# EAGLE schematic hab_tracker (EAGLE 8.2.2)

## Sheet 1 of 2
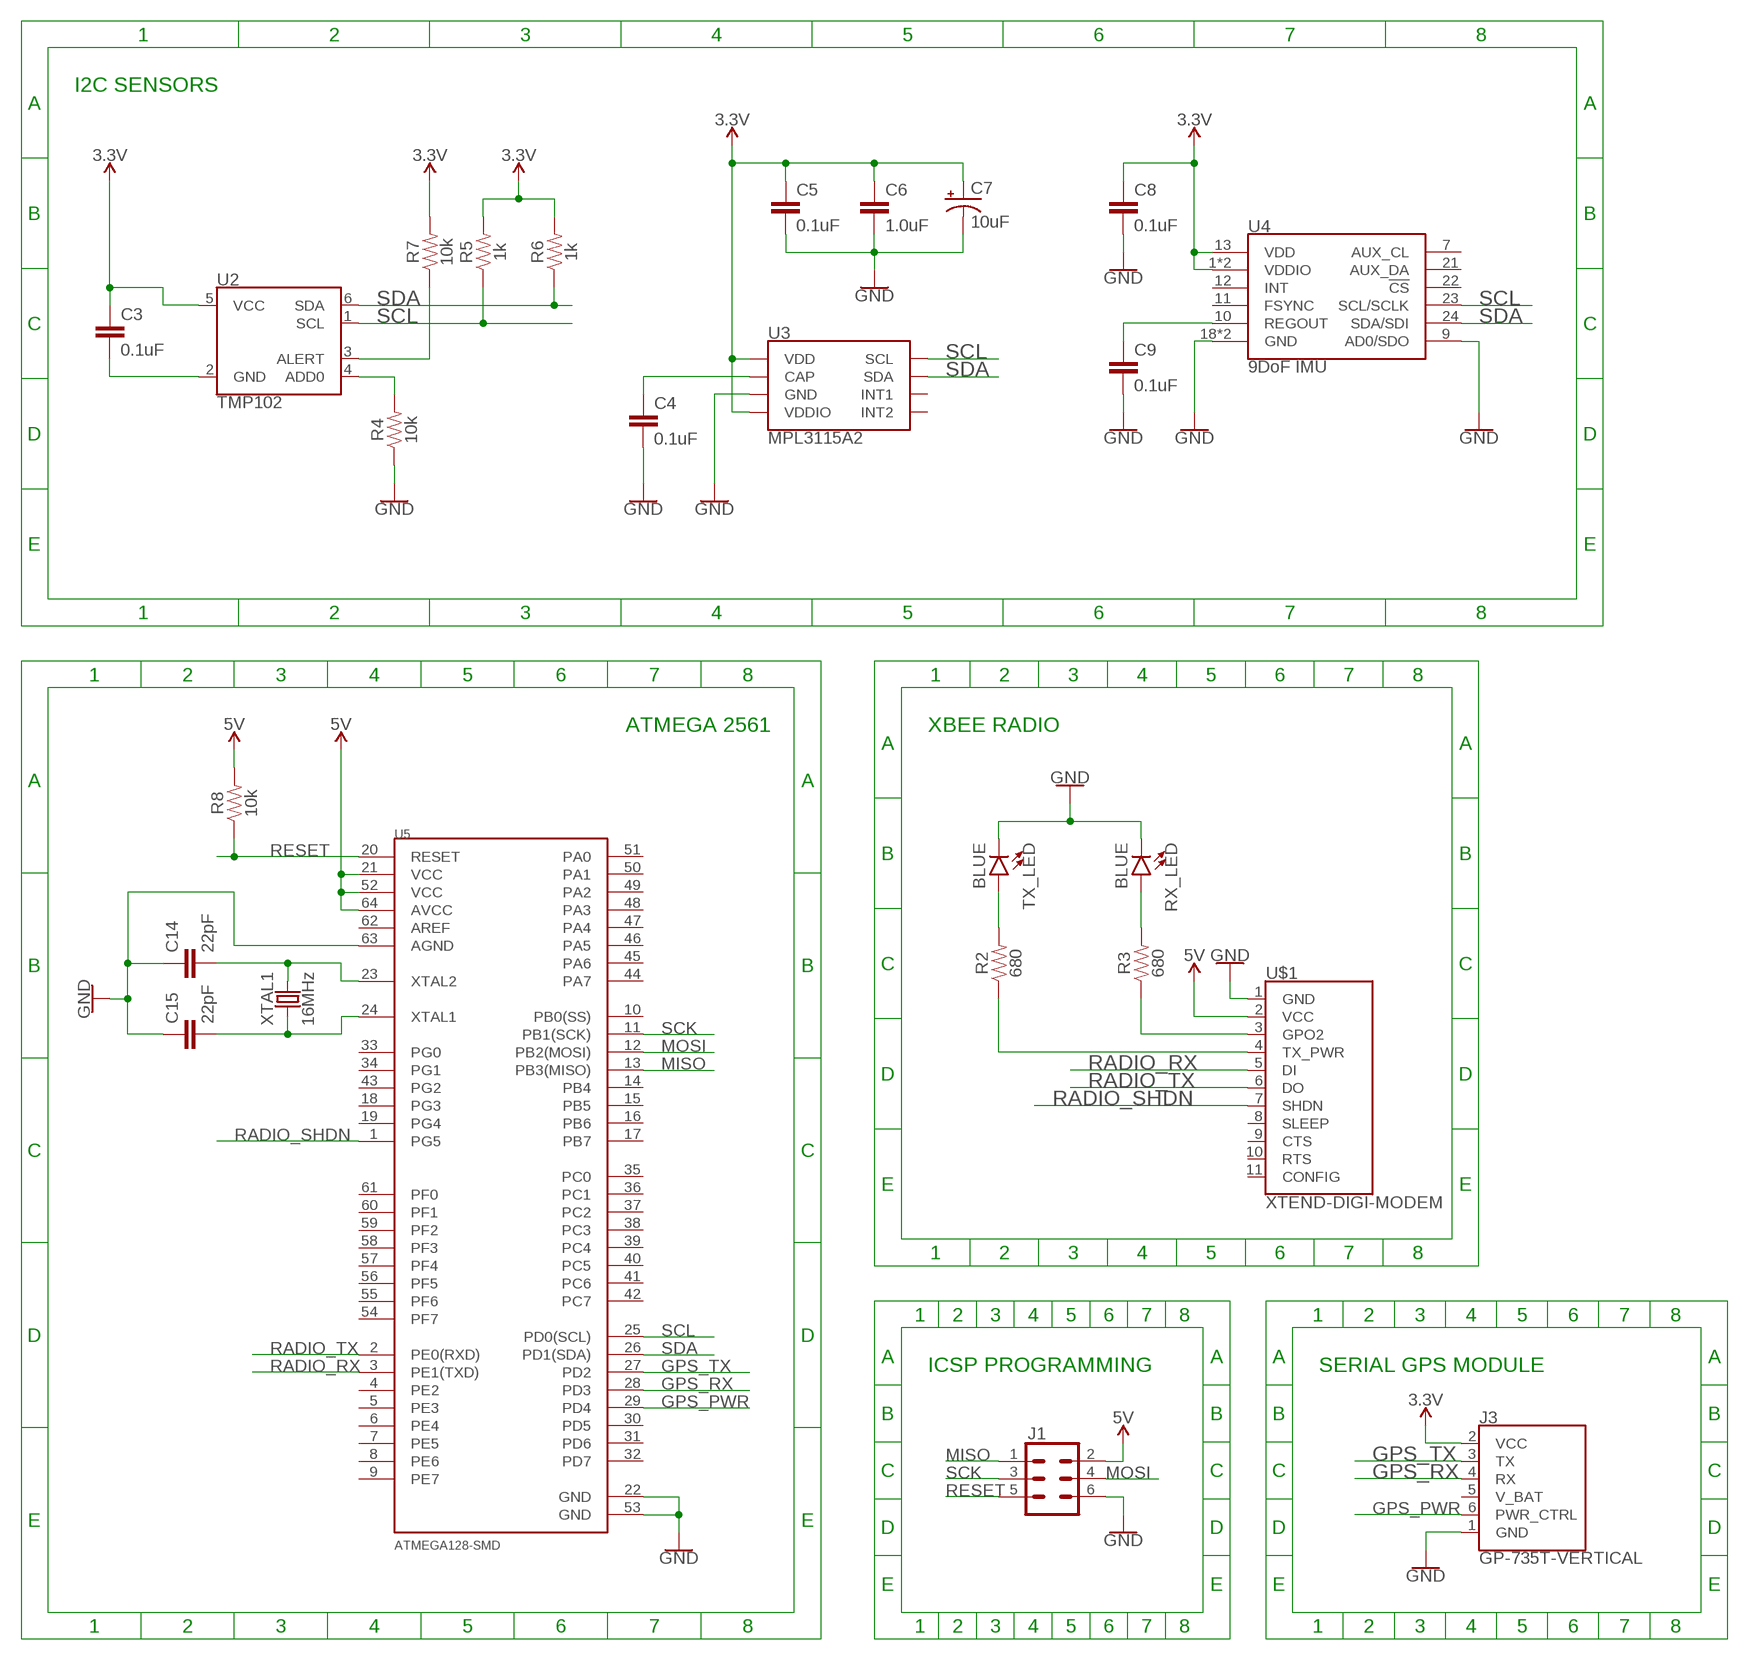
[diagram p0: schematic, sheet 1]

### Parts
C3  0.1uF  0.1UF-0603-25V-(+80/-20%)  [0603]
C4  0.1uF  0.1UF-0603-25V-(+80/-20%)  [0603]
C5  0.1uF  0.1UF-KIT-EZ-50V-20%  [CAP-PTH-SMALL-KIT]
C6  1.0uF  1.0UF-0603-16V-10%  [0603]
C7  10uF  10UF-POLAR-0603-6.3V-20%(TANT)  [0603-POLAR]
C8  0.1uF  0.1UF-KIT-EZ-50V-20%  [CAP-PTH-SMALL-KIT]
C9  0.1uF  0.1UF-KIT-EZ-50V-20%  [CAP-PTH-SMALL-KIT]
C14  22pF  22PF-0603-50V-5%  [0603]
C15  22pF  22PF-0603-50V-5%  [0603]
J1  CONN_03X2SHROUD  [2X3-SHROUDED]
J3  GP-735T-VERTICAL  [JST-6PIN-1MM]
R2  680  680OHM-0603-1/10W-5%  [0603]
R3  680  680OHM-0603-1/10W-5%  [0603]
R4  10k  10KOHM-0603-1/10W-1%  [0603]
R5  1k  1KOHM-0603-1/10W-1%  [0603]
R6  1k  1KOHM-0603-1/10W-1%  [0603]
R7  10k  10KOHM-0603-1/10W-1%  [0603]
R8  10k  10KOHM-0603-1/10W-1%  [0603]
RX_LED  BLUE  LED-BLUE1206  [LED-1206]
TX_LED  BLUE  LED-BLUE1206  [LED-1206]
U2  TMP102  [SOT563]
U3  MPL3115A2  [LGA-8-5X3]
U4  9DoF IMU  MPU-9250  [QFN24-3X3]
U5  ATMEGA128-SMD  [TQFP64_14X14MM]
U$1  XTEND-DIGI-MODEM  [XTEND-DIGI-MODEM]
XTAL1  16MHz  CRYSTAL-16MHZSMD-5X3.2  [CRYSTAL-SMD-5X3.2-4PAD]

### Nets
3.3V: C3.1 C5.1 C6.1 C7.+ C8.1 J3.2(VCC) R5.2 R6.2 R7.2 U2.5(VCC) U3.1(VDD) U3.4(VDDIO) U4.1(VDDIO) U4.8(VDDIO) U4.13(VDD) ; also sheet 2
5V: J1.2 R8.2 U5.21(VCC) U5.52(VCC) U5.64(AVCC) U$1.2(VCC) ; also sheet 2
GND: C4.2 C5.2 C6.2 C7.- C8.2 C9.2 C14.1 C15.1 J1.6 J3.1(GND) R4.1 RX_LED.C TX_LED.C U3.3(GND) U4.9(AD0/SDO) U4.18(GND) U4.20(GND) U5.22(GND) U5.53(GND) U5.63(AGND) U$1.1(GND) ; also sheet 2
GPS_PWR: J3.6(PWR_CTRL) U5.29(PD4)
GPS_RX: J3.4(RX) U5.28(PD3)
GPS_TX: J3.3(TX) U5.27(PD2)
MISO: J1.1 U5.13(PB3(MISO))
MOSI: J1.4 U5.12(PB2(MOSI))
N$3: R3.1 U$1.3(GPO2)
N$4: R2.1 U$1.4(TX_PWR)
N$5: R2.2 TX_LED.A
N$6: R3.2 RX_LED.A
N$7: C9.1 U4.10(REGOUT)
N$8: C3.2 U2.2(GND)
N$9: R7.1 U2.3(ALERT)
N$10: C4.1 U3.2(CAP)
N$11: R4.2 U2.4(ADD0)
N$16: C14.2 U5.23(XTAL2) XTAL1.3
N$17: C15.2 U5.24(XTAL1) XTAL1.1
RADIO_RX: U5.3(PE1(TXD)) U$1.5(DI)
RADIO_SHDN: U5.1(PG5) U$1.7(SHDN)
RADIO_TX: U5.2(PE0(RXD)) U$1.6(DO)
RESET: J1.5 R8.1 U5.20(RESET)
SCK: J1.3 U5.11(PB1(SCK))
SCL: R5.1 U2.1(SCL) U3.8(SCL) U4.23(SCL/SCLK) U5.25(PD0(SCL))
SDA: R6.1 U2.6(SDA) U3.7(SDA) U4.24(SDA/SDI) U5.26(PD1(SDA))
Unconnected: J3.5(V_BAT) U3.5(INT2) U3.6(INT1) U4.7(AUX_CL) U4.11(FSYNC) U4.12(INT) U4.21(AUX_DA) U4.22(!CS) U5.4(PE2) U5.5(PE3) U5.6(PE4) U5.7(PE5) U5.8(PE6) U5.9(PE7) U5.10(PB0(SS)) U5.14(PB4) U5.15(PB5) U5.16(PB6) U5.17(PB7) U5.18(PG3) U5.19(PG4) U5.30(PD5) U5.31(PD6) U5.32(PD7) U5.33(PG0) U5.34(PG1) U5.35(PC0) U5.36(PC1) U5.37(PC2) U5.38(PC3) U5.39(PC4) U5.40(PC5) U5.41(PC6) U5.42(PC7) U5.43(PG2) U5.44(PA7) U5.45(PA6) U5.46(PA5) U5.47(PA4) U5.48(PA3) U5.49(PA2) U5.50(PA1) U5.51(PA0) U5.54(PF7) U5.55(PF6) U5.56(PF5) U5.57(PF4) U5.58(PF3) U5.59(PF2) U5.60(PF1) U5.61(PF0) U5.62(AREF) U$1.8(SLEEP) U$1.9(CTS) U$1.10(RTS) U$1.11(CONFIG)

### Notes on the sheet
- I2C SENSORS
- ATMEGA 2561 | XBEE RADIO
- ICSP PROGRAMMING | SERIAL GPS MODULE

## Sheet 2 of 2
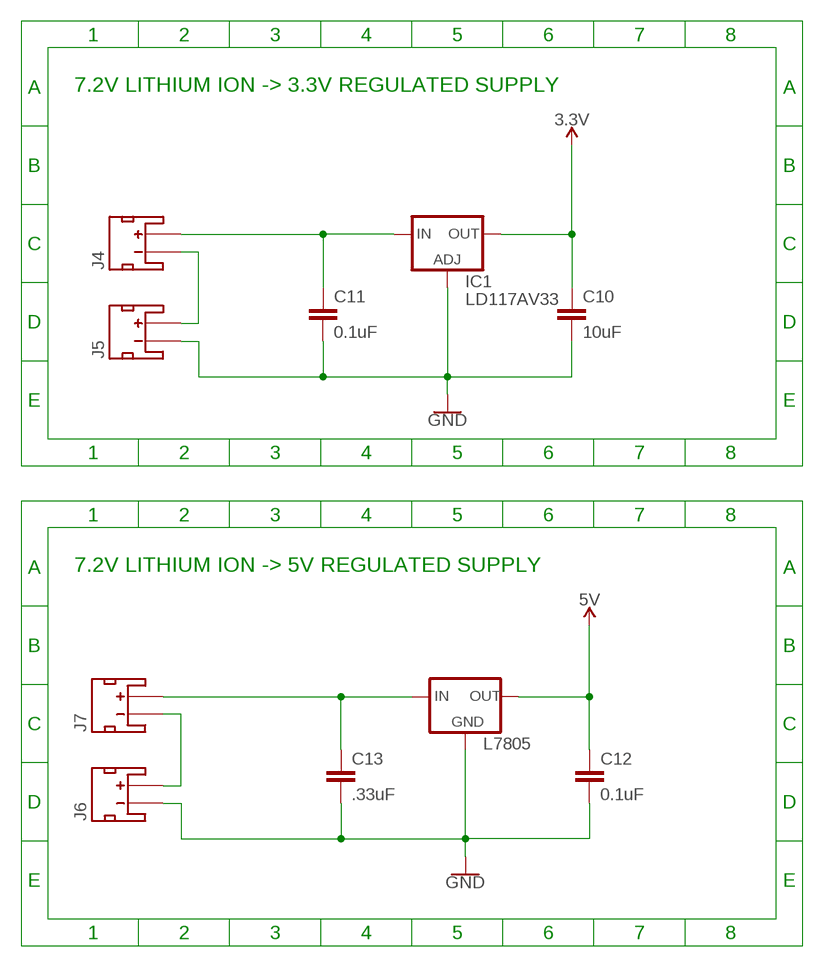
[diagram p1: schematic, sheet 2]

### Parts
C10  10uF  10UF-0603-6.3V-20%  [0603]
C11  0.1uF  0.1UF-0603-25V-(+80/-20%)  [0603]
C12  0.1uF  0.1UF-0603-25V-(+80/-20%)  [0603]
C13  .33uF  1.0NF/1000PF-0603-50V-10%  [0603]
IC1  LD117AV33  [TO220L1]
J4  JST_2MM_MALE  [JST-2-SMD]
J5  JST_2MM_MALE  [JST-2-SMD]
J6  JST_2MM_MALE  [JST-2-SMD]
J7  JST_2MM_MALE  [JST-2-SMD]
L7805  V_REG_78XX-TO-220  [TO-220-ALT]

### Nets
3.3V: C10.1 IC1.2(OUT) ; also sheet 1
5V: C12.1 L7805.OUT ; also sheet 1
GND: C10.2 C11.2 C12.2 C13.2 IC1.1(ADJ) J5.1(-) J6.1(-) L7805.GND ; also sheet 1
N$12: J4.1(-) J5.2(+)
N$13: C11.1 IC1.3(IN) J4.2(+)
N$14: J6.2(+) J7.1(-)
N$15: C13.1 J7.2(+) L7805.IN
Unconnected: J4.NC1(PAD1) J4.NC2(PAD2) J5.NC1(PAD1) J5.NC2(PAD2) J6.NC1(PAD1) J6.NC2(PAD2) J7.NC1(PAD1) J7.NC2(PAD2)

### Notes on the sheet
- 7.2V LITHIUM ION -> 3.3V REGULATED SUPPLY
- 7.2V LITHIUM ION -> 5V REGULATED SUPPLY

## Library data of the parts
C3 C4 C11 C12 = SparkFun-Capacitors:0.1UF: 0.1µF ceramic capacitors A capacitor is a passive two-terminal electrical component used to store electrical energy temporarily in an electric field.; PROD_ID: CAP-00810
C5 C8 C9 = SparkFun-Capacitors:0.1UF: 0.1µF ceramic capacitors A capacitor is a passive two-terminal electrical component used to store electrical energy temporarily in an electric field.; PROD_ID: CAP-08370
C6 = SparkFun-Capacitors:1.0UF: 1µF ceramic capacitors A capacitor is a passive two-terminal electrical component used to store electrical energy temporarily in an electric field.; PROD_ID: CAP-00868
C7 = SparkFun-Capacitors:10UF-POLAR: 10.0µF polarized capacitors A capacitor is a passive two-terminal electrical component used to store electrical energy temporarily in an electric field.; PROD_ID: CAP-13210
C10 = SparkFun-Capacitors:10UF: 10.0µF ceramic capacitors A capacitor is a passive two-terminal electrical component used to store electrical energy temporarily in an electric field.; PROD_ID: CAP-11015
C13 = SparkFun-Capacitors:1.0NF/1000PF: 1nF/1,000pF ceramic capacitors A capacitor is a passive two-terminal electrical component used to store electrical energy temporarily in an electric field.; PROD_ID: CAP-07886; VALUE: 1nF
C14 C15 = SparkFun-Capacitors:22PF: 22pF ceramic capacitors A capacitor is a passive two-terminal electrical component used to store electrical energy temporarily in an electric field.; PROD_ID: CAP-07876
IC1 = v-reg:LD117A?*: Low drop fixed and adjustable positive voltage regulators 1 A Source: http://www.st.com/stonline/products/literature/ds/7194/ld1117axx.pdf
J1 = SparkFun-Connectors:CONN_03X2: Multi connection point. Often used as Generic Header-pin footprint for 0.1 inch spaced/style header connections You can populate with any combo of single row headers, but if you'd like an exact match, check these: Header - 2x3 (Male, 0.1") <https://www.sparkfun.com/products/12807> (PRT-12807) Header - 2x3 (Female, 0.1") <https://www.sparkfun.com/products/13010> (PRT-13010) 2x3 Pin Shrouded Header <https://www.sparkfun.com/products/10877> (PRT-10877) On any of the 0.1 inch spaced packages, you can populate with these: Break Away Headers - Straight <https://www.sparkfun.com/products/116> (PRT-00116) Break Away Male Headers - Right Angle <https://www.sparkfun.com/products/553> (PRT-00553) Female Headers <https://www.sparkfun.com/products/115> (PRT-00115) Break Away Headers - Machine Pin <https://www.sparkfun.com/products/117> (PRT-00117) Break Away Female Headers - Swiss Machine Pin <https://www.sparkfun.com/products/743> (PRT-00743) Special note: the shrouded connector mates well with our 3x2 ribbon cables: Ribbon Crimp Connector - 6-pin (2x3, Female) <https://www.sparkfun.com/products/10651> (PRT-10651) Ribbon Cable - 6 wire (15ft) <https://www.sparkfun.com/products/10646> (PRT-10646); PROD_ID: CONN-10681; SF_ID: PRT_10877
J3 = SparkFun-GPS:GP-735T: ADH-tech GP-735 - Easy-to-use, Ultra-high performance, GPS Smart Antenna Module ADH-tech GP-735 is a slim, ultra-high performance, easy to use GPS smart antenna module designed with u-blox’s latest 7th generation single chip. This feature rich GPS module not only shortens the design efforts but also provides powerful functions. The compact design allows fast adoption and high yield production. The power control feature is very convenient to turn on/off power just via GPIO control pin. It’s especially useful to turn off power as the GPS function is not needed in the host applications. Datasheet <https://cdn.sparkfun.com/datasheets/GPS/GP-735T-150203.pdf> SparkFun Products GPS Receiver - GP-735 (56 Channel) <https://www.sparkfun.com/products/13670> (GPS-13670); PROD_ID: CONN-08249
J4-J7 = SparkFun-Connectors:JST_2MM_MALE: JST 2MM MALE RA CONNECTOR Two pin, compact surface mount connector. Commonly used as a battery input connection point. We really like the solid locking feeling and high current rating on these small connectors. We use these all the time as battery connectors. Mates to single-cell LiPo batteries. Here is the connector we sell at SparkFun: JST Right Angle Connector - White <https://www.sparkfun.com/products/8612> (PRT-08612) Datasheet <http://www.sparkfun.com/datasheets/Prototyping/Connectors/JST-Horizontal.pdf> It was used on these SparkFun products: SparkFun MOSFET Power Controller <https://www.sparkfun.com/products/11214> (PRT-11214) SparkFun Battery Babysitter - LiPo Battery Manager <https://www.sparkfun.com/products/13777> (PRT-13777) And many, many others that required a lipo battery connection.; PROD_ID: CONN-11443; SF_ID: PRT-08612
L7805 = SparkFun-IC-Power:V_REG_78XX: Voltage Regulator Standard 78xx regulator. IGO (Input Ground Output). Spark Fun Electronics SKU : COM-00107; PROD_ID: VREG-08450; SF_ID: COM-00107
R2 R3 = SparkFun-Resistors:680OHM: 680Ω resistor A resistor is a passive two-terminal electrical component that implements electrical resistance as a circuit element. Resistors act to reduce current flow, and, at the same time, act to lower voltage levels within circuits. - Wikipedia; PROD_ID: RES-09333
R4 R7 R8 = SparkFun-Resistors:10KOHM: 10kΩ resistor A resistor is a passive two-terminal electrical component that implements electrical resistance as a circuit element. Resistors act to reduce current flow, and, at the same time, act to lower voltage levels within circuits. - Wikipedia; PROD_ID: RES-00824
R5 R6 = SparkFun-Resistors:1KOHM: 1kΩ resistor A resistor is a passive two-terminal electrical component that implements electrical resistance as a circuit element. Resistors act to reduce current flow, and, at the same time, act to lower voltage levels within circuits. - Wikipedia; PROD_ID: RES-07856
RX_LED TX_LED = SparkFun-LED:LED-BLUE: Blue SMD LED Used in manufacturing of various products at SparkFun Packages: 0603 - SMD 0603 package [Product Link] <http://www.digikey.com/product-detail/en/SMLE12BC7TT86/511-1589-2-ND/1641808> 1206 - SMD1206 package [Product Link] <http://www.digikey.com/product-detail/en/lite-on-inc/LTST-C150TBKT/160-1643-1-ND/573584> SparkFun Products: ESP8266 Thing-Dev Board <https://www.sparkfun.com/products/13711> RedBoard <https://www.sparkfun.com/products/12757>; PROD_ID: DIO-09911
U2 = SparkFun-Sensors:TMP102: Texas Instruments TMP102 Low-Power Digital Temperature Sensor The TMP102 is a digital sensor (I2C a.k.a. TWI), has a resolution of 0.0625°C, and is accurate up to 0.5°C. This is a very handy sensor that requires a very low-current. Datasheet <http://www.sparkfun.com/datasheets/Sensors/Temperature/tmp102.pdf> SparkFun Products SparkFun Digital Temperature Sensor Breakout - TMP102 <https://www.sparkfun.com/products/11931> (SEN-11931); PROD_ID: IC-09303
U3 = SparkFun-Sensors:MPL3115A2: NXP MPL3115A2 Digital Altimeter/Pressure Sensor The MPL3115A2 is a compact piezoresistive absolute pressure sensor with an I2C interface. MPL3115 has a wide operating range of 20kPa to 110 kPa, a range that covers all surface elevations on Earth. The fully internally compensated MEMS in conjunction with an embedded high resolution 24-bit equivalent ADC provide accurate pressure [Pascals] /altitude [meters] and temperature [degrees Celsius] data. Datasheet <http://cdn.sparkfun.com/datasheets/Sensors/Pressure/MPL3115A2.pdf> SparkFun Products SparkFun Altitude/Pressure Sensor Breakout - MPL3115A2 <https://www.sparkfun.com/products/11084> (SEN-11084) SparkFun Weather Shield <https://www.sparkfun.com/products/12081> (DEV-12081) SparkFun Photon Weather Shield <https://www.sparkfun.com/products/13630> (DEV-13630); PROD_ID: IC-10869
U4 = SparkFun-Sensors:MPU-9250: MPU-9250 9 Degree of Freedom IMU System in Package that contains MPU-6500 & AK8963 NC pin 19. 2-6 & 14-17 not internally connected. May be used for PCB trace routing. Datasheet <https://cdn.sparkfun.com/assets/learn_tutorials/5/5/0/MPU9250REV1.0.pdf> SparkFun Products: SparkFun 9DoF Razor IMU M0 <https://www.sparkfun.com/products/14001> SparkFun IMU Breakout - MPU-9250 <https://www.sparkfun.com/products/13762>; PROD_ID: IC-13192
U5 = SparkFun-IC-Microcontroller:ATMEGA128: ATmega 128 ATmega128/128L/1281/2561. Note: The ATmega128 pin 1 is PEN and the ATmega256/1281 pin 1 is PG5. Not in catalog
U$1 = SparkFun-RF:XTEND-DIGI-MODEM: Digi XTend 900 1W RF Transceiver The XTend Modem packs a ton of RF punch into a small, low-power, easy-to-use, and reliable module. Outdoors, with line-of-sight, this module can communicate at up to 40 miles; indoors it can still do up to 3000ft. The module transfers a standard asynchronous serial data stream, operates within the ISM 900MHz frequency band and sustains up to 115.2kbps data throughput. The module comes with an attached RPSMA antenna connector. SparkFun Products XTend 900 1W RPSMA - 40 Mile Range <https://www.sparkfun.com/products/9411> (WRL-09411); SF_ID: WRL-09411
XTAL1 = SparkFun-Clocks:CRYSTAL-16MHZ: 16MHz Crystal Digikey Example <http://www.digikey.com/product-search/en?keywords=535-9122-1-ND> Frequency: 16MHz Frequency Stability: ±50ppm Frequency Tolerance: ±20ppm Load Capacitance: 18pF SparkFun Products: Pro Micro -5V/16MHz <https://www.sparkfun.com/products/12640> SparkFun Serial Enabled LCD Kit <https://www.sparkfun.com/products/10097>; PROD_ID: XTAL-08218; SF_ID: COM-00094